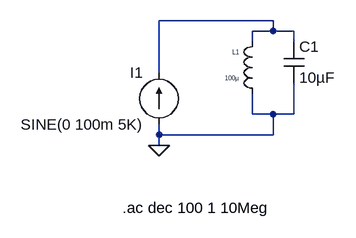
[diagram p0: schematic Lesson22_Parallel_AC.asc]
Lesson22_Parallel_AC.asc, the LTspice schematic file:
Version 4
SHEET 1 880 736
WIRE 112 432 -64 432
WIRE 112 448 112 432
WIRE 112 448 80 448
WIRE 144 448 112 448
WIRE 80 464 80 448
WIRE 144 464 144 448
WIRE -64 512 -64 432
WIRE 80 576 80 544
WIRE 112 576 80 576
WIRE 144 576 144 528
WIRE 144 576 112 576
WIRE -64 608 -64 592
WIRE 112 608 112 576
WIRE 112 608 -64 608
WIRE -64 624 -64 608
FLAG -64 624 0
SYMBOL current -64 592 R180
WINDOW 0 24 80 Left 2
WINDOW 3 24 0 Left 2
SYMATTR InstName I1
SYMATTR Value SINE(0 100m 5K)
SYMATTR Value2 AC 100m 0
SYMBOL ind 96 560 R180
WINDOW 0 36 80 Left 0
WINDOW 3 36 40 Left 0
SYMATTR InstName L1
SYMATTR Value 100µ
SYMATTR SpiceLine Ipk=1 Rser=85m Rpar=infin. Cpar=0 mfg="Coiltronics" pn="CTX100-1-52"
SYMBOL cap 128 464 R0
SYMATTR InstName C1
SYMATTR Value 10µF
TEXT -120 720 Left 2 !.ac dec 100 1 10Meg

The netlist it stands for:
* Lesson22_Parallel_AC.asc
I1 0 N001 SINE(0 100m 5K) AC 100m 0
L1 0 N001 100µ Ipk=1 Rser=85m Rpar=infin. Cpar=0 mfg="Coiltronics" pn="CTX100-1-52"
C1 N001 0 10µF
.ac dec 100 1 10Meg
.backanno
.end